# Altium schematic sheet FPGA MIO.SchDoc
size A4; SheetNumber: 7; SheetTotal: 9
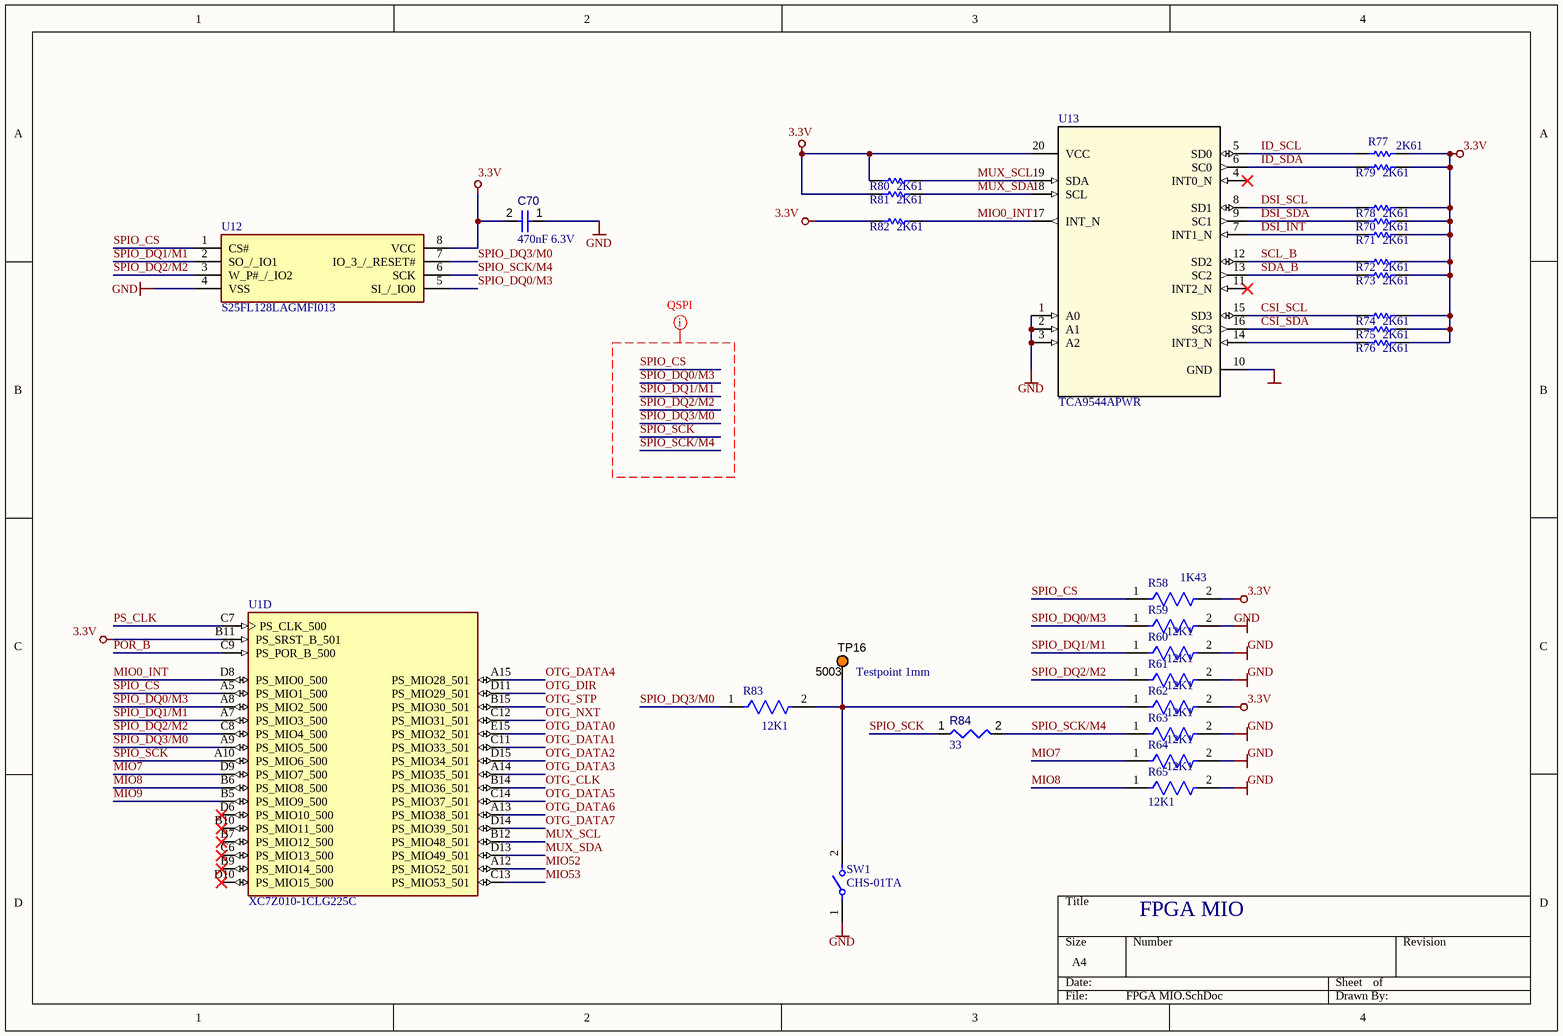
[diagram p0: FPGA MIO.SchDoc]

## Parts
C70  value 470nF 6.3V  [CAPC0603(1608)100_L]  (hidden comment: Capacitor 470nF +/-20% 25V 0603)
R58  1K43  [FP-RMCF1210-IPC_B]
R59  12K1  [FP-RMCF0805-MFG]
R60  12K1  [FP-RMCF0805-MFG]
R61  12K1  [FP-RMCF0805-MFG]
R62  12K1  [FP-RMCF0805-MFG]
R63  12K1  [FP-RMCF0805-MFG]
R64  12K1  [FP-RMCF0805-MFG]
R65  12K1  [FP-RMCF0805-MFG]
R70  2K61  [RESC1812(4532)_N]
R71  2K61  [RESC1812(4532)_N]
R72  2K61  [RESC1812(4532)_N]
R73  2K61  [RESC1812(4532)_N]
R74  2K61  [RESC1812(4532)_N]
R75  2K61  [RESC1812(4532)_N]
R76  2K61  [RESC1812(4532)_N]
R77  2K61  [RESC1812(4532)_N]
R78  2K61  [RESC1812(4532)_N]
R79  2K61  [RESC1812(4532)_N]
R80  2K61  [RESC1812(4532)_N]
R81  2K61  [RESC1812(4532)_N]
R82  2K61  [RESC1812(4532)_N]
R83  12K1  [FP-RMCF0805-MFG]
R84  value 33  [RESC1005X40X25ML10T10]  (hidden comment: Resistor 33R +/-1% 0402 63 mW)
SW1  CHS-01TA  [FP-CHS-01TA-MFG]
TP16  5003  [KSTN-5003]
U1  XC7Z010-1CLG225C  [BGA225C80P15X15_1300X1300X150]  (part D of 6)
U12  S25FL128LAGMFI013  [SOIC127P800X216-8N]
U13  TCA9544APWR  [PW0020A_N]

## Nets
GND: C70.1 C70.2 R58.2 R59.2 R60.2 R61.2 R62.2 R63.2 R64.2 R65.2 R70.2 R71.2 R72.2 R73.2 R74.2 R75.2 R76.2 R77.2 R78.2 R79.2 R80.1 R81.1 R82.1 SW1.1 U1.B11(PS_SRST_B_501) U12.4(VSS) U12.8(VCC) U13.1(A0) U13.2(A1) U13.3(A2) U13.10(GND) U13.20(VCC)
CSI_SCL: R74.1 U13.15(SD3)
CSI_SDA: R75.1 U13.16(SC3)
DSI_INT: R71.1 U13.7(INT1_N)
DSI_SCL: R78.1 U13.8(SD1)
DSI_SDA: R70.1 U13.9(SC1)
ID_SCL: R77.1 U13.5(SD0)
ID_SDA: R79.1 U13.6(SC0)
MIO0_INT: R82.2 U1.D8(PS_MIO0_500) U13.17(INT_N)
MIO7: R64.1 U1.D9(PS_MIO7_500)
MIO8: R65.1 U1.B6(PS_MIO8_500)
MIO9: U1.B5(PS_MIO9_500)
MIO52: U1.A12(PS_MIO52_501)
MIO53: U1.C13(PS_MIO53_501)
MUX_SCL: R80.2 U1.B12(PS_MIO48_501) U13.19(SDA)
MUX_SDA: R81.2 U1.D13(PS_MIO49_501) U13.18(SCL)
OTG_CLK: U1.B14(PS_MIO36_501)
OTG_DATA0: U1.E15(PS_MIO32_501)
OTG_DATA1: U1.C11(PS_MIO33_501)
OTG_DATA2: U1.D15(PS_MIO34_501)
OTG_DATA3: U1.A14(PS_MIO35_501)
OTG_DATA4: U1.A15(PS_MIO28_501)
OTG_DATA5: U1.C14(PS_MIO37_501)
OTG_DATA6: U1.A13(PS_MIO38_501)
OTG_DATA7: U1.D14(PS_MIO39_501)
OTG_DIR: U1.D11(PS_MIO29_501)
OTG_NXT: U1.C12(PS_MIO31_501)
OTG_STP: U1.B15(PS_MIO30_501)
POR_B: U1.C9(PS_POR_B_500)
PS_CLK: U1.C7(PS_CLK_500)
SCL_B: R72.1 U13.12(SD2)
SDA_B: R73.1 U13.13(SC2)
SPIO_CS: R58.1 U1.A5(PS_MIO1_500) U12.1(CS#)
SPIO_DQ0/M3: R59.1 U1.A8(PS_MIO2_500) U12.5(SI_/_IO0)
SPIO_DQ1/M1: R60.1 U1.A7(PS_MIO3_500) U12.2(SO_/_IO1)
SPIO_DQ2/M2: R61.1 U1.C8(PS_MIO4_500) U12.3(W_P#_/_IO2)
SPIO_DQ3/M0: R83.1 U1.A9(PS_MIO5_500) U12.7(IO_3_/_RESET#)
SPIO_SCK: R84.1 U1.A10(PS_MIO6_500)
SPIO_SCK/M4: R63.1 R84.2 U12.6(SCK)
NetR62_1: R62.1 R83.2 SW1.2 TP16.1
NetR76_1: R76.1 U13.14(INT3_N)

Not connected (* = marked no-connect by the designer): U1 B7(PS_MIO12_500)* B9(PS_MIO14_500)* B10(PS_MIO11_500)* C6(PS_MIO13_500)* D6(PS_MIO10_500)* D10(PS_MIO15_500)*; U13 4(INT0_N)* 11(INT2_N)*

## Layout directives
mark named QSPI: SPIO_CS, SPIO_DQ0/M3, SPIO_DQ1/M1, SPIO_DQ2/M2, SPIO_DQ3/M0, SPIO_SCK, SPIO_SCK/M4

## Notes on the sheet
- (near TP16) Testpoint 1mm
- FPGA MIO
- Labels drawn without touching a wire or pin: 3.3V, GND

## Library data of the parts
C70 = CMP-001-00077-3: Chip Capacitor, 470nF +/-20%, 25V, 0603, Thickness 1 mm; Tolerance: 10%; Max Operating Temperature: 85°C; Voltage Rating: 25V; Pins: 2; Case/Package: 0603; Mounting Technology: SMT; Min Operating Temperature: -55°C
R58 = CMP-26527-001165-1: 1.43kΩ ±1% 0.5W 1210 Thick Film Chip Resistor AEC-Q200 compliant; Resistance: 1.43kR; Temperature Coefficient: 100ppm/°C; Max Power Dissipation: 333mW; Tolerance: 1%; Number of Terminations: 2; Series: RMCF; Height: 0.028inch; Case/Package: 1210; Min Operating Temperature: -55°C; RoHS Compliant: Yes; Length: 0.126inch; Packaging: Tape and Reel; Width: 0.098inch; Contact Plating: Tin; Radiation Hardening: No; Mount: Surface Mount; Max Operating Temperature: 155°C; Features: Automotive AEC-Q200; Resistor Type: Thick Film
R59-R65 R83 = CMP-26527-006221-1: 12.1kΩ ±1% 0.125W 0805 Thick Film Chip Resistor AEC-Q200 compliant; Temperature Coefficient: 100ppm/°C; Resistance: 12.1kR; Max Power Dissipation: 125mW; Features: Automotive AEC-Q200; Mount: Surface Mount; Max Operating Temperature: 155°C; Case Code (Imperial): 0805; Height: 0.026inch; Series: RMCF; Radiation Hardening: No; Width: 0.049inch; Length: 0.079inch; Contact Plating: Tin; Case Code (Metric): 2012; Packaging: Tape and Reel; Number of Terminations: 2; Resistor Type: Thick Film; RoHS Compliant: Yes; Tolerance: 1%; Case/Package: 0805; Min Operating Temperature: -55°C; Package Quantity: 10000
R70-R82 = CMP-1016-00535-1: 2K61 0.75W 1% 1812 (4532 Metric)  SMD; Case-EIA: 1812; Case-Metric: 4532; Value: 2610.00 Ohm; Power: 0.75 W; Technology: SMT; Tolerance: 1 %
R84 = CMP-009-00029-5: Chip Resistor, 33 Ohm, +/- 1%, 0.063 W, -55 to 155 degC, 0402 (1005 Metric); Power: 63mW; Pins: 2; Mounting Technology: SM; Min Operating Temperature: -55°C; Tolerance: 1%; Max Operating Temperature: 155°C; RoHS Compliant: True; Case/Package: 0402
SW1 = CMP-71740-000003-1: SWITCH SLIDE DIP SPST 100MA 6V; Manufacturer: Nidec Copal Electronics; Contact Resistance: 50mΩ; Standoff Height: 0mm; Number Of Circuits: 1; Electromechanical Life: 2000Cycles; Device Class L1: Electromechanical; Device Class L2: Switches; Category: Switch; Temperature Range Low: -40°C; Device Class L3: DIP Switches; Height: 2.5mm; Lead Free: Yes; Octopart: https://octopart.com/chs-01ta-nidec+copal-52304644; Throw Configuration: SPST; Package: CHS-01TA; Voltage Rating Dc: 6V; Digikey Description: SWITCH SLIDE DIP SPST 100MA 6V; Mount: Surface Mount; Automotive: No; Contact Current Rating: 100mA; ComponentLink2URL: https://www.nidec-copal-electronics.com/e/catalog/switch/chs.pdf; ComponentLink2Description: Datasheet; Temperature: -40°C to +85°C; Temperature Range High: +85°C; RoHS: TRUE; Manufacturer Part Number: CHS-01TA
TP16 = CMP-002-00037-2: Test Point, Orange, Height 4.6 mm, Tail Length 3 mm, 1-Pin THD, RoHS; Manufacturer: Keystone; Colour: Orange; Packaging: Bulk; Package Description: 1-Pin Through Hole Device, Dia 2.54 mm; Pins: 1; Package Reference: 5003; Datasheet Version: Jun-15; Case/Package: 5003; Mounting Technology: TH; Connector Type: TestPoint; Diameter: 2.54mm; Contact Material: Bronze; Datasheet URL: http://keyelco.com/userAssets/file/M65p56.pdf; Manufacturer URL: http://www.keyelco.com/; Package Quantity: 10; Contact Plating: Tin; RoHS Compliant: True
U1 = CMP-049-000000-1: Dual ARMÂ® CortexÂ®-A9 MPCoreâ„¢ with CoreSightâ„¢ System On Chip _SOC_ IC ZynqÂ®-7000 Artixâ„¢-7 FPGA, 28K Logic Cells 667MHz 225-CSPBGA _13x13_; MF: Xilinx Inc.; Digi-Key_Part_Number: 122-1855-ND; Component Type: Standard; SnapEDA_Link: https://www.snapeda.com/parts/XC7Z010-1CLG225C/Xilinx%20Inc./view-part/45778/?ref=snap; Value: *; Package: CSPBGA-225 Xilinx; MP: XC7Z010-1CLG225C; Design Item ID: XC7Z010-1CLG225C; Source: SnapEDAsch.SchLib; Digi-Key_Purchase_URL: https://www.digikey.by/product-detail/en/xilinx-inc/XC7Z010-1CLG225C/122-1855-ND/3925788?utm_source=snapeda&utm_medium=aggregator&utm_campaign=symbol; Pin Count: 225
U12 = S25FL128LAGMFI013: Integrated Circuit; Manufacturer_Name: Infineon; Datasheet Link: https://www.arrow.com/en/products/s25fl128lagmfi013/cypress-semiconductor; Height: 2.16mm; Manufacturer_Part_Number: S25FL128LAGMFI013; Mouser Part Number: 727-S25FL128LAGMF013; Mouser Price/Stock: https://www.mouser.co.uk/ProductDetail/Infineon-Technologies/S25FL128LAGMFI013?qs=HXFqYaX1Q2w0394QEiiGSw%3D%3D; Arrow Part Number: S25FL128LAGMFI013; Arrow Price/Stock: https://www.arrow.com/en/products/s25fl128lagmfi013/infineon-technologies-ag?utm_currency=USD&region=nac
U13 = CMP-047-000000-1: 4-channel 1.65- to 5.5-V I2C/SMBus multiplexer with interrupt & voltage translation 20-TSSOP -40 to 85; Manufacturer_Name: Texas Instruments; CompType: IC; MountType: SMT; Copyright: Copyright (C) 2025 Ultra Librarian. All rights reserved.; RoHS: Y; RefDes: RefDes; SymbolVerison: 2015-05-04; TYPE: TYPE; Datasheet: https://www.ti.com/lit/gpn/tca9544a; PartNumber: TCA9544APWR; Manufacturer_Part_Number: TCA9544APWR; Source: TCA9544APWR.SchLib; PackageReference: PW0020A; Design Item ID: TCA9544APWR; Manufacturer: Texas Instruments